# Altium schematic sheet POWER.SchDoc
size A3; SheetNumber: 4; SheetTotal: 8
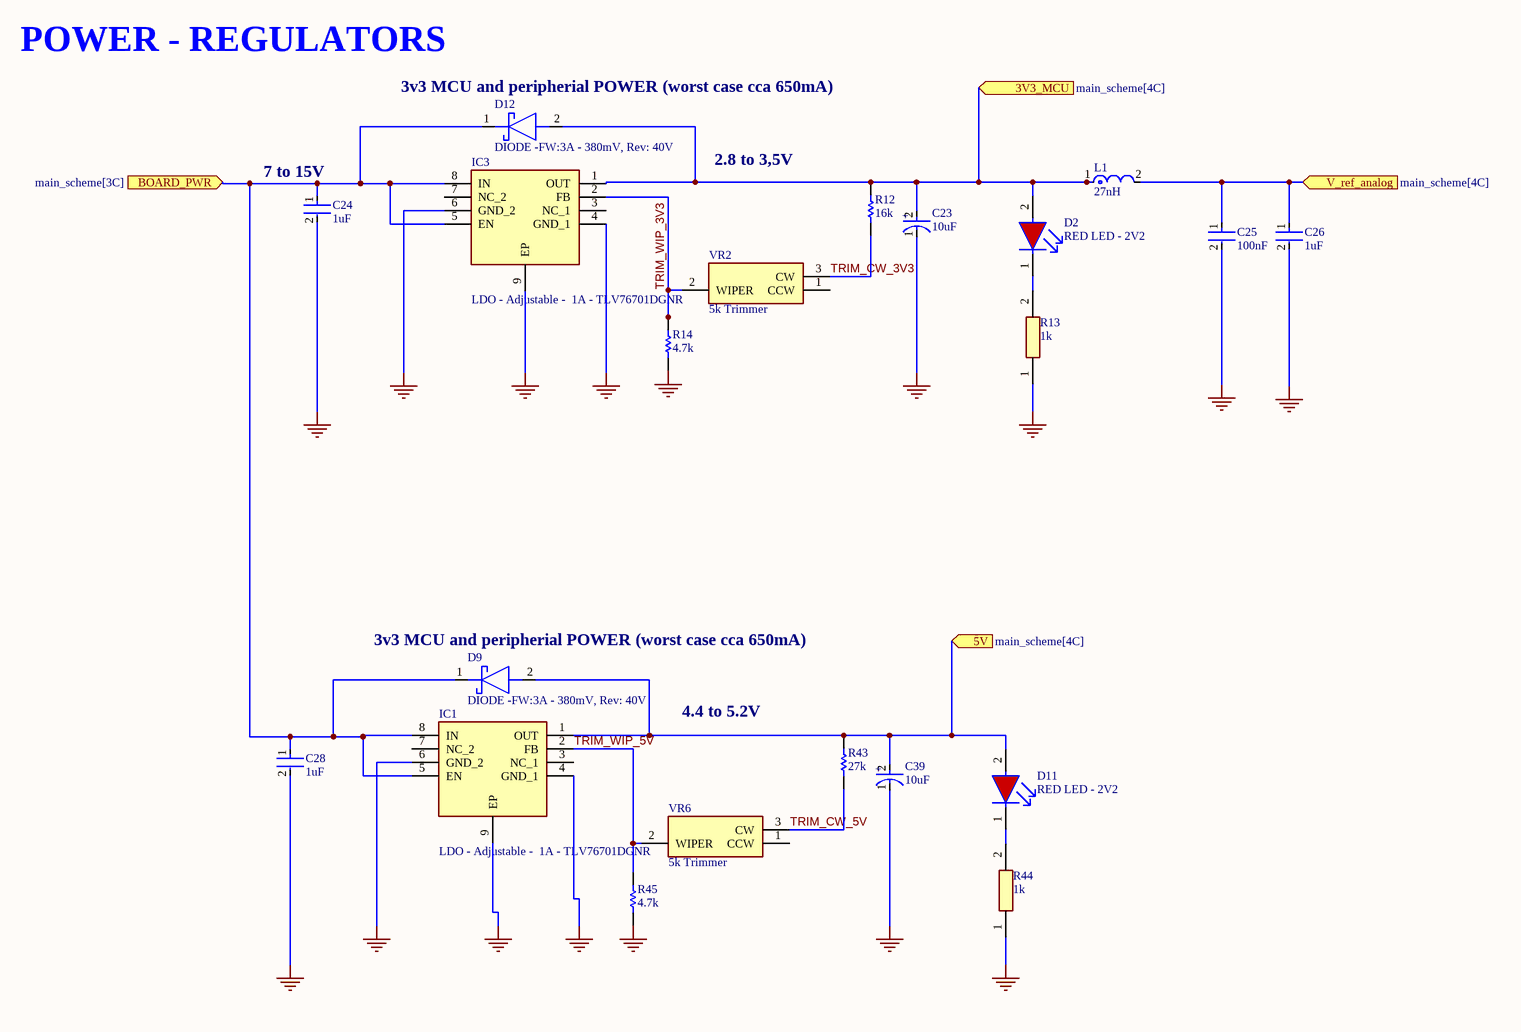
[diagram p0: POWER.SchDoc]

## Parts
C23  10uF  [0603_tantal]
C24  1uF  [0603-CAP]
C25  100nF  [0402 CAP]
C26  1uF  [0603-CAP]
C28  1uF  [0603-CAP]
C39  10uF  [0603_tantal]
D2  RED LED - 2V2  [0603_RED_LED]
D9  DIODE -FW:3A - 380mV, Rev: 40V  [DIONM5127X229N]
D11  RED LED - 2V2  [0603_RED_LED]
D12  DIODE -FW:3A - 380mV, Rev: 40V  [DIONM5127X229N]
IC1  LDO - Adjustable -  1A - TLV76701DGNR  [SOP65P490X110-9N]
IC3  LDO - Adjustable -  1A - TLV76701DGNR  [SOP65P490X110-9N]
L1  27nH  [0603-INDUCT]
R12  16k  [RESC1005X40X25NL05T05]
R13  1k  [0603- SMD resistor]
R14  4.7k  [RESC1005X40X25NL05T05]
R43  27k  [RESC1005X40X25NL05T05]
R44  1k  [0603- SMD resistor]
R45  4.7k  [RESC1005X40X25NL05T05]
VR2  5k Trimmer  [TC33X2503E]
VR6  5k Trimmer  [TC33X2503E]

## Ports
3V3_MCU (in, see main_scheme[4C]), 5V (in, see main_scheme[4C]), BOARD_PWR (in, see main_scheme[3C]), V_ref_analog (in, see main_scheme[4C])

## Nets
GND: C23.1(C) C24.2 C25.2 C26.2 C28.2 C39.1(C) IC1.4(GND_1) IC1.6(GND_2) IC1.9(EP) IC3.4(GND_1) IC3.6(GND_2) IC3.9(EP) R13.1 R14.2 R44.1 R45.2
3V3_MCU: C23.2(A) D2.2(A) D12.2(A) IC3.1(OUT) L1.1 R12.1 ; port 3V3_MCU
5V: C39.2(A) D9.2(A) D11.2(A) IC1.1(OUT) R43.1 ; port 5V
BOARD_PWR: C24.1 C28.1 D9.1(K) D12.1(K) IC1.5(EN) IC1.8(IN) IC3.5(EN) IC3.8(IN) ; port BOARD_PWR
TRIM_CW_3V3: R12.2 VR2.3(CW)
TRIM_CW_5V: R43.2 VR6.3(CW)
TRIM_WIP_3V3: IC3.2(FB) R14.1 VR2.2(WIPER)
TRIM_WIP_5V: IC1.2(FB) R45.1 VR6.2(WIPER)
V_ref_analog: C25.1 C26.1 L1.2 ; port V_ref_analog
NetD2_1: D2.1(C) R13.2
NetD11_1: D11.1(C) R44.2

Not connected (* = marked no-connect by the designer): IC1 3(NC_1) 7(NC_2); IC3 3(NC_1) 7(NC_2); VR2 1(CCW); VR6 1(CCW)

## Notes on the sheet
- POWER - REGULATORS
- (near D12) 3v3 MCU and peripherial POWER (worst case cca 650mA)
- 2.8 to 3,5V
- (near C24) 7 to 15V
- (near D9) 3v3 MCU and peripherial POWER (worst case cca 650mA)
- 4.4 to 5.2V
- (in symbol CAP 0603 Tantal -10uF) +

## Library data of the parts
C23 C39 = CAP 0603 Tantal -10uF: CAP TANT POLY 10UF 10V 0603 20%; PartNumber: F381A106MMAAH1; Package: 0603; Value: 10uF; ComponentLink1Description: myLinks; ComponentLink1URL: https://cz.mouser.com/ProductDetail/KYOCERA-AVX/F381A106MMAAH1?qs=sGAEpiMZZMtZ1n0r9vR22Q2XOsfGOI9effSA9nDSSSNE17O0WlLegw%3D%3D; Supplier 1: Mouser; Supplier Part Number 1: 581-F381A106MMAAH1
C24 C26 C28 = CAP-0603-1uF: General Purpose Ceramic Capacitor, 0603,1uF,25V,10%; PartNumber: C1608X7R1E105K080AB; ComponentLink1Description: myLinks; ComponentLink1URL: https://cz.mouser.com/ProductDetail/TDK/C1608X7R1E105K080AB?qs=NRhsANhppD8okfR52aTdVA%3D%3D; Package: 0603; Value: 1uF; Supplier 1: Mouser; Supplier Part Number 1: 810-C1608X7R1E105K
C25 = CAP 0402 - 100nF: Cap Ceramic 0402,0.1uF, 25V,10%; PartNumber: C0402C104K3RACTU; Value: 100nF; Package: 0402; Supplier 1: Mouser; Supplier Part Number 1: 80-C0402C104K3R; ComponentLink1Description: myLinks; ComponentLink1URL: https://eu.mouser.com/ProductDetail/KEMET/C0402C104K3RACTU?qs=YCcZ0GhAU2q7BaxZ%2FluQHA%3D%3D
D2 D11 = LED - 0603 - RED - 2V2: LED RED DIFFUSED 0603 SMD; PartNumber: SML-D12U1WT86; Value: RED LED - 2.2V; Package: 0602; ComponentLink1Description: myLinks; ComponentLink1URL: https://cz.mouser.com/ProductDetail/ROHM-Semiconductor/SML-D12U1WT86?qs=M3jcYzEJUdEySuGkbjHEtQ%3D%3D; Supplier 1: Mouser; Supplier Part Number 1: 755-SML-D12U1WT86
D9 D12 = DIODE -FW:3A - 380mV, Rev: 40V: Schottky DIODE -  DO-214AC-2 -FW:3A - 380mV, Rev: 40V; PartNumber: SSA34HE3_A/I; ComponentLink1Description: New link; ComponentLink1URL: https://cz.mouser.com/ProductDetail/Vishay-General-Semiconductor/SSA34HE3_A-I?qs=asPD7ZL2j3VimMFbwwU%2FoA%3D%3D; Value: FW:3A - 380mV, Rev: 40V; Package: DO-214AC-2; Supplier 1: Mouser; Supplier Part Number 1: 78-SSA34HE3_A/I
IC1 IC3 = LDO - Adjustable -  1A - TLV76701DGNR: Adjustable  LDO - Input: min 2.5V,max 16V. Output: 0.8V  to 14.6V 1A; Value: Adjustable 1A LDO; ComponentLink1Description: myLinks; ComponentLink1URL: https://cz.mouser.com/ProductDetail/Texas-Instruments/TLV76701DGNR?qs=QNEnbhJQKvYlzprjZl22mQ%3D%3D; Package: HVSSOP-8; PartNumber: TLV76701DGNR; Supplier 1: Mouser; Supplier Part Number 1: 595-TLV76701DGNR
L1 = Induct - 0603 -27nH: Multilayer type RF Inductor 27nH ±5% 0.54Ω 500mA 0603; PartNumber: LQG18HN27NJ00D; ComponentLink1Description: myLinks; ComponentLink1URL: https://cz.mouser.com/ProductDetail/Murata-Electronics/LQG18HN27NJ00D?qs=Ak0FrV9sSEhd5kkENoxyIg%3D%3D; Value: 27nH; Package: 0603; Supplier 1: Mouser; Supplier Part Number 1: 81-LQG18HN27NJ00D
R12 = Resistor - 0402 - 16k: Resistor - 0402 -  16k - 1% - 100mW; PartNumber: ERJ-2RKF1602X; Value: 16k; Package: 0402; ComponentLink1Description: myLinks; ComponentLink1URL: https://cz.mouser.com/ProductDetail/Panasonic/ERJ-2RKF1602X?qs=MVjVSMjNRMp9pwpCSUWuGw%3D%3D; Supplier 1: Mouser; Supplier Part Number 1: 667-ERJ-2RKF1602X
R13 R44 = RESISTOR - 0603 - 1k: Resistor 0603 1KR 100mW 1%; PartNumber: RT0603FRE071KL; ComponentLink1Description: myLinks; ComponentLink1URL: https://cz.mouser.com/ProductDetail/YAGEO/RT0603FRE071KL?qs=8cPjvKtxWv68ZVEzoi6JxQ%3D%3D; Value: 1k; Package: 0603; Supplier 1: Mouser; Supplier Part Number 1: 603-RT0603FRE071KL
R14 R45 = Resistor - 0402 - 4.7k: Resistor - 0402 -  4.7k - 1% - 100mW; PartNumber: ERJ-2RKF4701X; Value: 4.7k; Package: 0402; ComponentLink1Description: myLinks; ComponentLink1URL: https://cz.mouser.com/ProductDetail/Panasonic/ERJ-2RKF4701X?qs=H7k1u0Mp9JQWpspavPhQZA%3D%3D; Supplier 1: Mouser; Supplier Part Number 1: 667-ERJ-2RKF4701X
R43 = Resistor - 0402 - 27k: Resistor - 0402 - 27k - 1% - 100mW; PartNumber: ERJ-H2RD2702X; Value: 27k; Package: 0402; ComponentLink1Description: myLinks; ComponentLink1URL: https://cz.mouser.com/ProductDetail/Panasonic/ERJ-H2RD2702X?qs=eP2BKZSCXI50Sdsvimutzw%3D%3D; Supplier 1: Mouser; Supplier Part Number 1: 667-ERJ-H2RD2702X
VR2 VR6 = TRIMMER - 5k -100mW: Variable Resistor Trimmer - 5k - 25% -100mW - single turn; PartNumber: TC33X-2-502E; Package: 3mm SMD TRIMPOT; Value: 5k; ComponentLink1Description: myLinks; ComponentLink1URL: https://cz.mouser.com/ProductDetail/Bourns/TC33X-2-502E?qs=r%252B5EJQndA0pTgyiJsDuA%252BA%3D%3D; Supplier 1: Mouser; Supplier Part Number 1: 652-TC33X-2-502E